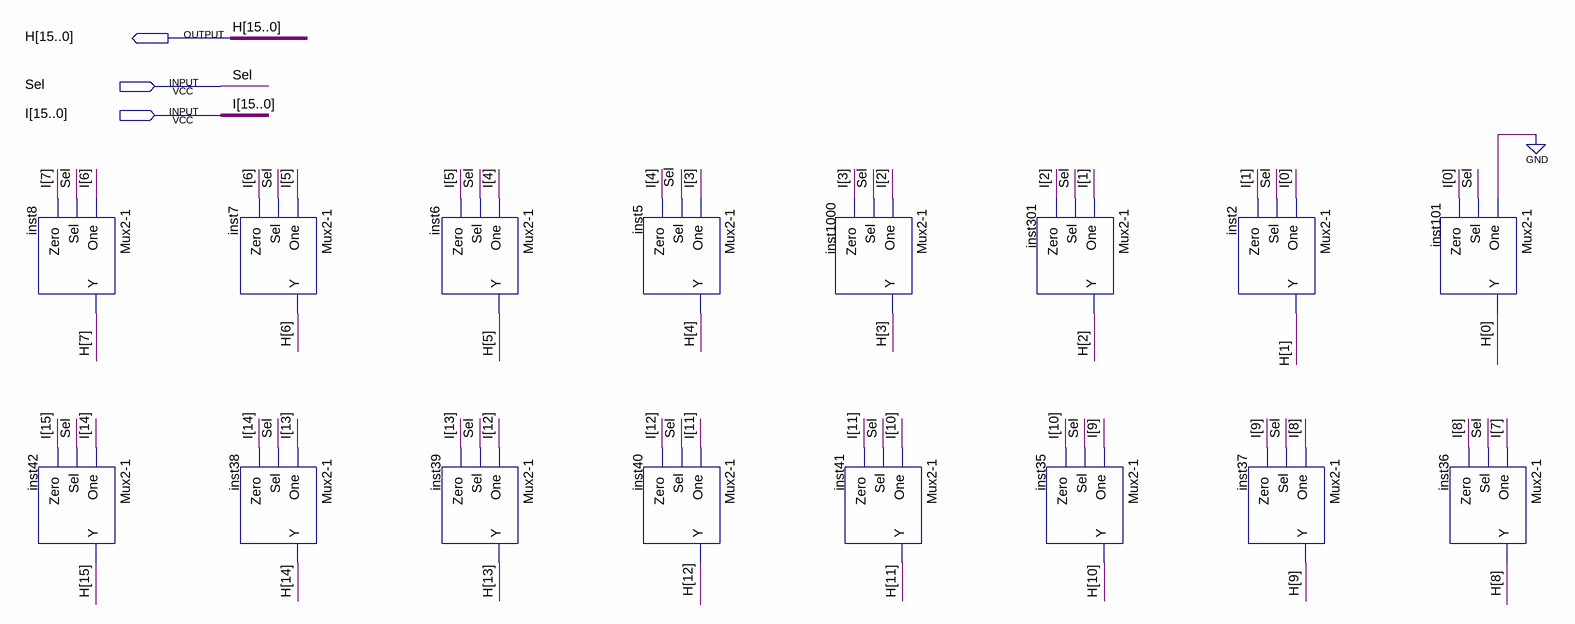
[diagram p0: schematic sheet]
// Quartus schematic ShifterX2.bdf as structural Verilog: 16 symbols, 3 pins
module ShifterX2 (
  input  Sel,
  input  [15:0] I,
  output [15:0] H
);

  \Mux2-1  inst8 (.One(I[6]), .Sel(Sel), .Zero(I[7]), .Y(H[7]));
  \Mux2-1  inst42 (.One(I[14]), .Sel(Sel), .Zero(I[15]), .Y(H[15]));
  \Mux2-1  inst7 (.One(I[5]), .Sel(Sel), .Zero(I[6]), .Y(H[6]));
  \Mux2-1  inst38 (.One(I[13]), .Sel(Sel), .Zero(I[14]), .Y(H[14]));
  \Mux2-1  inst6 (.One(I[4]), .Sel(Sel), .Zero(I[5]), .Y(H[5]));
  \Mux2-1  inst39 (.One(I[12]), .Sel(Sel), .Zero(I[13]), .Y(H[13]));
  \Mux2-1  inst5 (.One(I[3]), .Sel(Sel), .Zero(I[4]), .Y(H[4]));
  \Mux2-1  inst40 (.One(I[11]), .Sel(Sel), .Zero(I[12]), .Y(H[12]));
  \Mux2-1  inst1000 (.One(I[2]), .Sel(Sel), .Zero(I[3]), .Y(H[3]));
  \Mux2-1  inst41 (.One(I[10]), .Sel(Sel), .Zero(I[11]), .Y(H[11]));
  \Mux2-1  inst301 (.One(I[1]), .Sel(Sel), .Zero(I[2]), .Y(H[2]));
  \Mux2-1  inst35 (.One(I[9]), .Sel(Sel), .Zero(I[10]), .Y(H[10]));
  \Mux2-1  inst2 (.One(I[0]), .Sel(Sel), .Zero(I[1]), .Y(H[1]));
  \Mux2-1  inst37 (.One(I[8]), .Sel(Sel), .Zero(I[9]), .Y(H[9]));
  \Mux2-1  inst101 (.One(1'b0), .Sel(Sel), .Zero(I[0]), .Y(H[0]));
  \Mux2-1  inst36 (.One(I[7]), .Sel(Sel), .Zero(I[8]), .Y(H[8]));
endmodule
